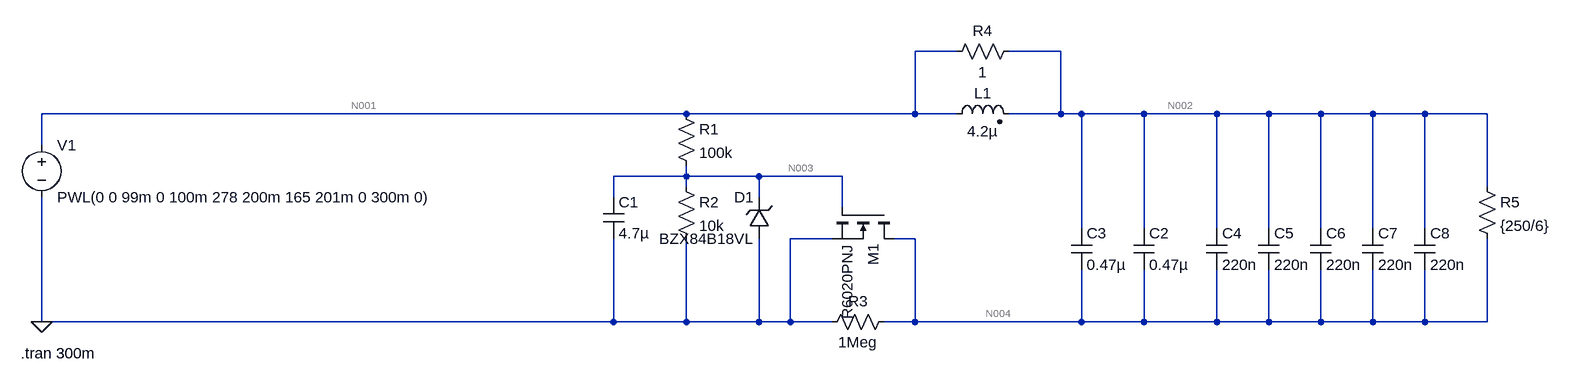
[diagram p0: schematic SST.asc]
SST.asc, the LTspice schematic file:
Version 4
SHEET 1 2492 680
WIRE 1280 -96 1216 -96
WIRE 1440 -96 1360 -96
WIRE 864 0 -128 0
WIRE 1216 0 1216 -96
WIRE 1216 0 864 0
WIRE 1280 0 1216 0
WIRE 1440 0 1440 -96
WIRE 1440 0 1360 0
WIRE 1472 0 1440 0
WIRE 1568 0 1472 0
WIRE 1680 0 1568 0
WIRE 1760 0 1680 0
WIRE 1840 0 1760 0
WIRE 1920 0 1840 0
WIRE 2000 0 1920 0
WIRE 2096 0 2000 0
WIRE -128 48 -128 0
WIRE 864 96 864 80
WIRE 864 96 752 96
WIRE 976 96 864 96
WIRE 1104 96 976 96
WIRE 864 112 864 96
WIRE 2096 112 2096 0
WIRE 752 128 752 96
WIRE 976 128 976 96
WIRE 1104 144 1104 96
WIRE 1472 176 1472 0
WIRE 1568 176 1568 0
WIRE 1680 176 1680 0
WIRE 1760 176 1760 0
WIRE 1840 176 1840 0
WIRE 1920 176 1920 0
WIRE 2000 176 2000 0
WIRE 1088 192 1024 192
WIRE 1216 192 1184 192
WIRE -128 320 -128 128
WIRE 752 320 752 192
WIRE 752 320 -128 320
WIRE 864 320 864 192
WIRE 864 320 752 320
WIRE 976 320 976 192
WIRE 976 320 864 320
WIRE 1024 320 1024 192
WIRE 1024 320 976 320
WIRE 1088 320 1024 320
WIRE 1216 320 1216 192
WIRE 1216 320 1168 320
WIRE 1472 320 1472 240
WIRE 1472 320 1216 320
WIRE 1568 320 1568 240
WIRE 1568 320 1472 320
WIRE 1680 320 1680 240
WIRE 1680 320 1568 320
WIRE 1760 320 1760 240
WIRE 1760 320 1680 320
WIRE 1840 320 1840 240
WIRE 1840 320 1760 320
WIRE 1920 320 1920 240
WIRE 1920 320 1840 320
WIRE 2000 320 2000 240
WIRE 2000 320 1920 320
WIRE 2096 320 2096 192
WIRE 2096 320 2000 320
FLAG -128 320 0
SYMBOL voltage -128 32 R0
WINDOW 123 0 0 Left 0
WINDOW 39 0 0 Left 0
SYMATTR InstName V1
SYMATTR Value PWL(0 0 99m 0 100m 278 200m 165 201m 0 300m 0)
SYMBOL res 848 -16 R0
SYMATTR InstName R1
SYMATTR Value 100k
SYMBOL res 848 96 R0
SYMATTR InstName R2
SYMATTR Value 10k
SYMBOL nmos 1184 144 R90
SYMATTR InstName M1
SYMATTR Value R6020PNJ
SYMBOL cap 736 128 R0
SYMATTR InstName C1
SYMATTR Value 4.7µ
SYMBOL res 1184 304 R90
WINDOW 0 0 56 VBottom 2
WINDOW 3 32 56 VTop 2
SYMATTR InstName R3
SYMATTR Value 1Meg
SYMBOL zener 992 192 R180
WINDOW 0 24 64 Left 2
WINDOW 3 24 0 Left 2
SYMATTR InstName D1
SYMATTR Value BZX84B18VL
SYMATTR Description Diode
SYMATTR Type diode
SYMBOL cap 1552 176 R0
SYMATTR InstName C2
SYMATTR Value 0.47µ
SYMATTR SpiceLine V=630 Irms=0 Rser=0.0363 Lser=15.3n mfg="Würth Elektronik" pn="890303426008CS WCAP-FTBE 22.5 x 26 x 18 x 9" type="Box"
SYMBOL cap 1456 176 R0
SYMATTR InstName C3
SYMATTR Value 0.47µ
SYMATTR SpiceLine V=630 Irms=0 Rser=0.0363 Lser=15.3n mfg="Würth Elektronik" pn="890303426008CS WCAP-FTBE 22.5 x 26 x 18 x 9" type="Box"
SYMBOL ind2 1264 16 R270
WINDOW 0 32 56 VTop 2
WINDOW 3 5 56 VBottom 2
SYMATTR InstName L1
SYMATTR Value 4.2µ
SYMATTR Type ind
SYMATTR SpiceLine Ipk=5 Rser=11m
SYMBOL res 1264 -80 R270
WINDOW 0 32 56 VTop 2
WINDOW 3 0 56 VBottom 2
SYMATTR InstName R4
SYMATTR Value 1
SYMBOL res 2080 96 R0
SYMATTR InstName R5
SYMATTR Value {250/6}
SYMBOL cap 1664 176 R0
SYMATTR InstName C4
SYMATTR Value 220n
SYMATTR SpiceLine V=630 Rser=18
SYMBOL cap 1744 176 R0
SYMATTR InstName C5
SYMATTR Value 220n
SYMATTR SpiceLine V=630 Rser=18
SYMBOL cap 1824 176 R0
SYMATTR InstName C6
SYMATTR Value 220n
SYMATTR SpiceLine V=630 Rser=18
SYMBOL cap 1904 176 R0
SYMATTR InstName C7
SYMATTR Value 220n
SYMATTR SpiceLine V=630 Rser=18
SYMBOL cap 1984 176 R0
SYMATTR InstName C8
SYMATTR Value 220n
SYMATTR SpiceLine V=630 Rser=18
TEXT -160 368 Left 2 !.tran 300m

The netlist it stands for:
* SST.asc
V1 N001 0 PWL(0 0 99m 0 100m 278 200m 165 201m 0 300m 0)
R1 N001 N003 100k
R2 N003 0 10k
M1 N004 N003 0 0 R6020PNJ
C1 N003 0 4.7µ
R3 N004 0 1Meg
D1 0 N003 BZX84B18VL
C2 N002 N004 0.47µ V=630 Irms=0 Rser=0.0363 Lser=15.3n mfg="Würth Elektronik" pn="890303426008CS WCAP-FTBE 22.5 x 26 x 18 x 9" type="Box"
C3 N002 N004 0.47µ V=630 Irms=0 Rser=0.0363 Lser=15.3n mfg="Würth Elektronik" pn="890303426008CS WCAP-FTBE 22.5 x 26 x 18 x 9" type="Box"
L1 N001 N002 4.2µ Ipk=5 Rser=11m
R4 N001 N002 1
R5 N002 N004 {250/6}
C4 N002 N004 220n V=630 Rser=18
C5 N002 N004 220n V=630 Rser=18
C6 N002 N004 220n V=630 Rser=18
C7 N002 N004 220n V=630 Rser=18
C8 N002 N004 220n V=630 Rser=18
.model D D
.lib standard.dio
.model NMOS NMOS
.model PMOS PMOS
.lib standard.mos
.tran 300m
.backanno
.end

* Results of the author's LTspice run, read from the files saved beside the schematic
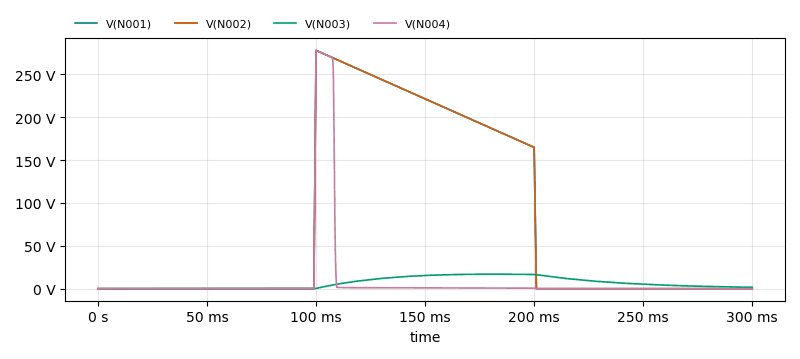
[diagram p1: Transient Analysis of SST.asc, plotted from the saved traces]
* Transient Analysis, 1 run:
*   V(N001): min 0 V, max 278 V, average 74.57 V, rms 129.7 V, last 0 V
*   V(N002): min -125.1 mV, max 278 V, average 74.55 V, rms 129.7 V, last 0 V
*   V(N003): min 0 V, max 16.92 V, average 6.553 V, rms 9.225 V, last 1.616 V
*   V(N004): min -62.39 mV, max 278 V, average 8.456 V, rms 46.24 V, last 0 V